# EAGLE design act-drive1 (EAGLE 9.4.2)
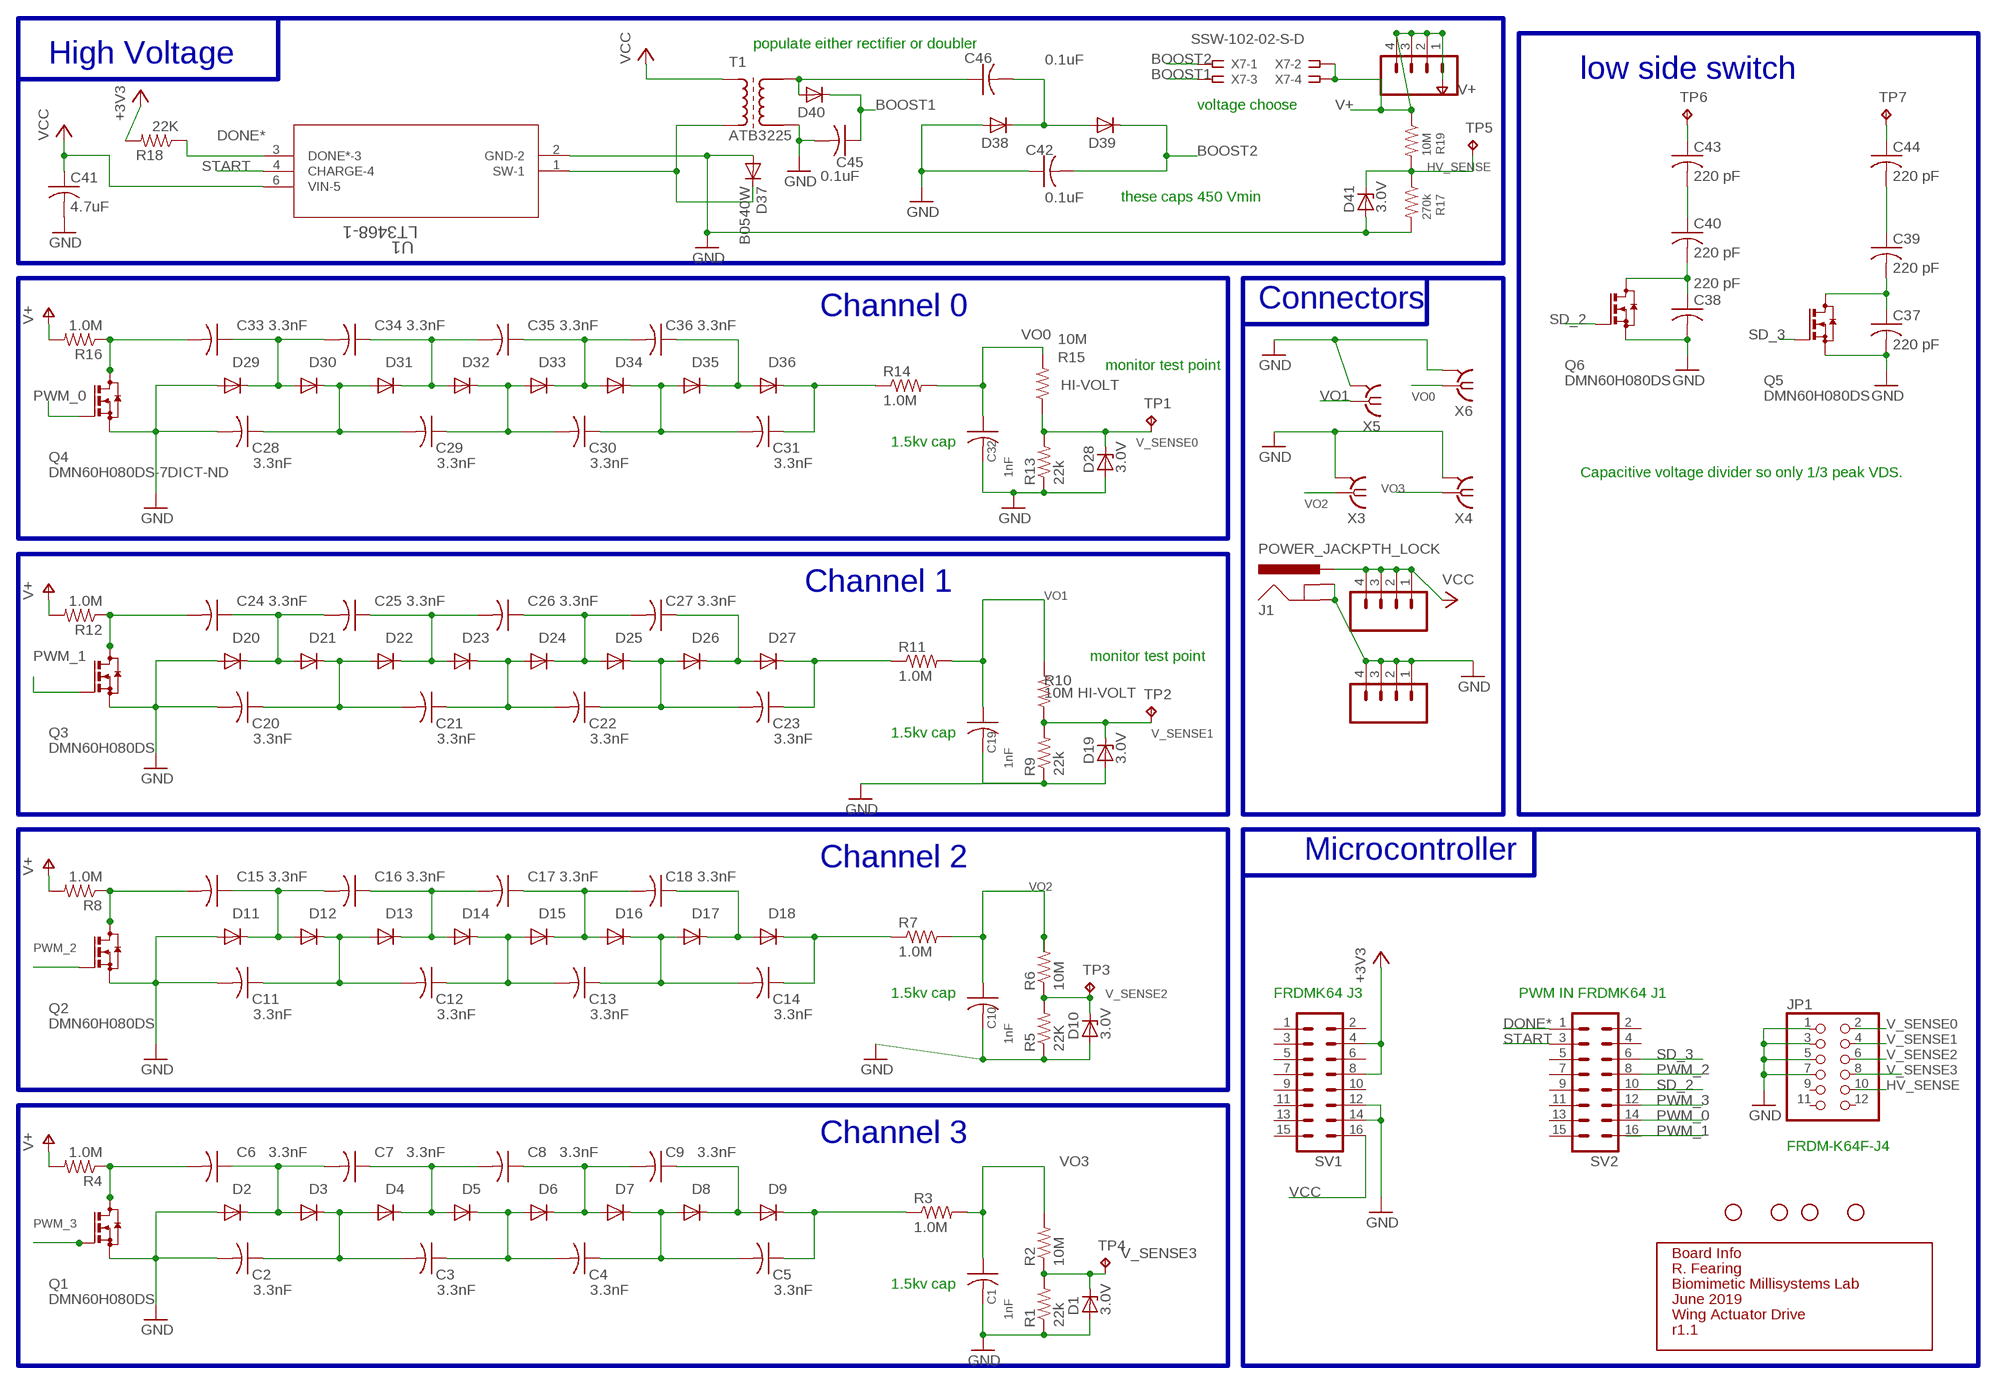
[diagram p0: schematic, sheet 1]

## Parts
C1  1nF  C-USC1206  [C1206]
C2  3.3nF  C-USC0805K  [C0805K]
C3  3.3nF  C-USC0805K  [C0805K]
C4  3.3nF  C-USC0805K  [C0805K]
C5  3.3nF  C-USC0805K  [C0805K]
C6  3.3nF  C-USC0805K  [C0805K]
C7  3.3nF  C-USC0805K  [C0805K]
C8  3.3nF  C-USC0805K  [C0805K]
C9  3.3nF  C-USC0805K  [C0805K]
C10  1nF  C-USC1206  [C1206]
C11  3.3nF  C-USC0805K  [C0805K]
C12  3.3nF  C-USC0805K  [C0805K]
C13  3.3nF  C-USC0805K  [C0805K]
C14  3.3nF  C-USC0805K  [C0805K]
C15  3.3nF  C-USC0805K  [C0805K]
C16  3.3nF  C-USC0805K  [C0805K]
C17  3.3nF  C-USC0805K  [C0805K]
C18  3.3nF  C-USC0805K  [C0805K]
C19  1nF  C-USC1206  [C1206]
C20  3.3nF  C-USC0805K  [C0805K]
C21  3.3nF  C-USC0805K  [C0805K]
C22  3.3nF  C-USC0805K  [C0805K]
C23  3.3nF  C-USC0805K  [C0805K]
C24  3.3nF  C-USC0805K  [C0805K]
C25  3.3nF  C-USC0805K  [C0805K]
C26  3.3nF  C-USC0805K  [C0805K]
C27  3.3nF  C-USC0805K  [C0805K]
C28  3.3nF  C-USC0805K  [C0805K]
C29  3.3nF  C-USC0805K  [C0805K]
C30  3.3nF  C-USC0805K  [C0805K]
C31  3.3nF  C-USC0805K  [C0805K]
C32  1nF  C-USC1206  [C1206]
C33  3.3nF  C-USC0805K  [C0805K]
C34  3.3nF  C-USC0805K  [C0805K]
C35  3.3nF  C-USC0805K  [C0805K]
C36  3.3nF  C-USC0805K  [C0805K]
C37  220 pF  C-USC1206  [C1206]
C38  220 pF  C-USC1206  [C1206]
C39  220 pF  C-USC1206  [C1206]
C40  220 pF  C-USC1206  [C1206]
C41  4.7uF  C-USC1206  [C1206]
C42  0.1uF  C-USC1206  [C1206]
C43  220 pF  C-USC1206  [C1206]
C44  220 pF  C-USC1206  [C1206]
C45  0.1uF  C-USC1206  [C1206]
C46  0.1uF  C-USC1206  [C1206]
D1  3.0V  ZENER-DIODESOD80C  [SOD80C]
D2  DIODE-SOD323-W  [SOD323-W]
D3  DIODE-SOD323-W  [SOD323-W]
D4  DIODE-SOD323-W  [SOD323-W]
D5  DIODE-SOD323-W  [SOD323-W]
D6  DIODE-SOD323-W  [SOD323-W]
D7  DIODE-SOD323-W  [SOD323-W]
D8  DIODE-SOD323-W  [SOD323-W]
D9  DIODE-SOD323-W  [SOD323-W]
D10  3.0V  ZENER-DIODESOD80C  [SOD80C]
D11  DIODE-SOD323-W  [SOD323-W]
D12  DIODE-SOD323-W  [SOD323-W]
D13  DIODE-SOD323-W  [SOD323-W]
D14  DIODE-SOD323-W  [SOD323-W]
D15  DIODE-SOD323-W  [SOD323-W]
D16  DIODE-SOD323-W  [SOD323-W]
D17  DIODE-SOD323-W  [SOD323-W]
D18  DIODE-SOD323-W  [SOD323-W]
D19  3.0V  ZENER-DIODESOD80C  [SOD80C]
D20  DIODE-SOD323-W  [SOD323-W]
D21  DIODE-SOD323-W  [SOD323-W]
D22  DIODE-SOD323-W  [SOD323-W]
D23  DIODE-SOD323-W  [SOD323-W]
D24  DIODE-SOD323-W  [SOD323-W]
D25  DIODE-SOD323-W  [SOD323-W]
D26  DIODE-SOD323-W  [SOD323-W]
D27  DIODE-SOD323-W  [SOD323-W]
D28  3.0V  ZENER-DIODESOD80C  [SOD80C]
D29  DIODE-SOD323-W  [SOD323-W]
D30  DIODE-SOD323-W  [SOD323-W]
D31  DIODE-SOD323-W  [SOD323-W]
D32  DIODE-SOD323-W  [SOD323-W]
D33  DIODE-SOD323-W  [SOD323-W]
D34  DIODE-SOD323-W  [SOD323-W]
D35  DIODE-SOD323-W  [SOD323-W]
D36  DIODE-SOD323-W  [SOD323-W]
D37  B0540W  DIODE-SOD123  [SOD123]
D38  DIODE-SOD323-W  [SOD323-W]
D39  DIODE-SOD323-W  [SOD323-W]
D40  DIODE-SOD323-W  [SOD323-W]
D41  3.0V  ZENER-DIODESOD80C  [SOD80C]
H1  STAND-OFFTIGHT  [STAND-OFF-TIGHT]
H2  STAND-OFFTIGHT  [STAND-OFF-TIGHT]
H3  STAND-OFFTIGHT  [STAND-OFF-TIGHT]
H4  STAND-OFFTIGHT  [STAND-OFF-TIGHT]
I1  INFO  [INFO]
J1  POWER_JACKPTH_LOCK  [POWER_JACK_PTH_LOCK]
JP1  PINHD-2X6  [2X06]
JP2  M04LOCK  [1X04_LOCK]
JP3  M04LOCK  [1X04_LOCK]
JP4  M04LOCK  [1X04_LOCK]
Q1  BSS123  [SOT23]
Q2  BSS123  [SOT23]
Q3  BSS123  [SOT23]
Q4  BSS123  [SOT23]
Q5  BSS123  [SOT23]
Q6  BSS123  [SOT23]
R1  22k  R-US_R1206  [R1206]
R2  10M  R-US_R2010  [R2010]
R3  1.0M  R-US_R1206  [R1206]
R4  1.0M  R-US_R1206  [R1206]
R5  22K  R-US_R1206  [R1206]
R6  10M  R-US_R2010  [R2010]
R7  1.0M  R-US_R1206  [R1206]
R8  1.0M  R-US_R1206  [R1206]
R9  22k  R-US_R1206  [R1206]
R10  10M  R-US_R2010  [R2010]
R11  1.0M  R-US_R1206  [R1206]
R12  1.0M  R-US_R1206  [R1206]
R13  22k  R-US_R1206  [R1206]
R14  1.0M  R-US_R1206  [R1206]
R15  10M  R-US_R2010  [R2010]
R16  1.0M  R-US_R1206  [R1206]
R17  270k  R-US_R1206  [R1206]
R18  22K  R-US_R1206  [R1206]
R19  10M  R-US_R1206  [R1206]
SV1  ML16  [ML16]
SV2  ML16  [ML16]
T1  ATB3225  [XFMR3225]
TP1  TPTP10SQ  [TP10SQ]
TP2  TPTP10SQ  [TP10SQ]
TP3  TPTP10SQ  [TP10SQ]
TP4  TPTP10SQ  [TP10SQ]
TP5  TPTP20SQ  [TP20SQ]
TP6  TPTP20SQ  [TP20SQ]
TP7  TPTP20SQ  [TP20SQ]
U1  LT3468-1  [TSOT-23_S5]
X3  SMA-142-0701-801/806  [J502-ND-142-0701-801/806]
X4  SMA-142-0701-801/806  [J502-ND-142-0701-801/806]
X5  SMA-142-0701-801/806  [J502-ND-142-0701-801/806]
X6  SMA-142-0701-801/806  [J502-ND-142-0701-801/806]
X7  SSW-102-02-S-D  [SSW-102-02-S-D]

## Nets
+3V3: R18.2 SV1.4 SV1.8
BOOST: C46.2 D38.C D39.A
BOOST1: C45.1 D40.C X7.3
BOOST2: C42.2 D39.C X7.1
DONE*: R18.1 SV2.1 U1.3(DONE*-3)
GND: C1.2 C2.2 C10.2 C11.2 C19.2 C20.2 C28.2 C32.2 C37.2 C38.2 C41.2 C42.1 C45.2 D1.A D2.A D10.A D11.A D19.A D20.A D28.A D29.A D37.A D38.A D41.A J1.GND J1.GNDBREAK JP1.1 JP1.3 JP1.5 JP1.7 JP2.1 JP2.2 JP2.3 JP2.4 Q1.2(S) Q2.2(S) Q3.2(S) Q4.2(S) Q5.2(S) Q6.2(S) R1.1 R5.1 R9.1 R13.1 R17.2 SV1.12 SV1.14 T1.S3 U1.2(GND-2) X3.G@1 X3.G@2 X3.G@3 X3.G@4 X4.G@1 X4.G@2 X4.G@3 X4.G@4 X5.G@1 X5.G@2 X5.G@3 X5.G@4 X6.G@1 X6.G@2 X6.G@3 X6.G@4
HV_SENSE: D41.C JP1.10 R17.1 R19.2 TP5.TP
N$1: C29.1 C30.2 D32.C D33.A
N$2: C33.1 C34.2 D29.C D30.A
N$3: C31.1 D36.C R14.1
N$4: C14.1 D18.C R7.1
N$5: C28.1 C29.2 D30.C D31.A
N$6: C46.1 D40.A T1.S2
N$7: C34.1 C35.2 D31.C D32.A
N$8: C33.2 Q4.3(D) R16.1
N$9: C23.1 D27.C R11.1
N$10: C35.1 C36.2 D33.C D34.A
N$11: C24.1 C25.2 D20.C D21.A
N$12: D37.C T1.P4 U1.1(SW-1)
N$13: C20.1 C21.2 D21.C D22.A
N$14: C27.1 D26.C D27.A
N$15: C21.1 C22.2 D23.C D24.A
N$16: C22.1 C23.2 D25.C D26.A
N$17: C15.1 C16.2 D11.C D12.A
N$18: C11.1 C12.2 D12.C D13.A
N$20: C18.1 D17.C D18.A
N$21: C25.1 C26.2 D22.C D23.A
N$22: C26.1 C27.2 D24.C D25.A
N$23: C24.2 Q3.3(D) R12.1
N$24: C12.1 C13.2 D14.C D15.A
N$25: C13.1 C14.2 D16.C D17.A
N$26: C5.1 D9.C R3.1
N$27: C16.1 C17.2 D13.C D14.A
N$29: C17.1 C18.2 D15.C D16.A
N$30: C15.2 Q2.3(D) R8.1
N$32: C6.1 C7.2 D2.C D3.A
N$33: C2.1 C3.2 D3.C D4.A
N$34: C9.1 D8.C D9.A
N$35: C3.1 C4.2 D5.C D6.A
N$36: C4.1 C5.2 D7.C D8.A
N$37: C7.1 C8.2 D4.C D5.A
N$38: C8.1 C9.2 D6.C D7.A
N$39: C6.2 Q1.3(D) R4.1
N$40: C43.1 TP6.TP
N$41: C40.1 C43.2
N$42: C38.1 C40.2 Q6.3(D)
N$43: C44.1 TP7.TP
N$44: C39.1 C44.2
N$45: C37.1 C39.2 Q5.3(D)
N$59: C36.1 D35.C D36.A
N$61: C30.1 C31.2 D34.C D35.A
PWM_0: Q4.1(G) SV2.14
PWM_1: Q3.1(G) SV2.16
PWM_2: Q2.1(G) SV2.8
PWM_3: Q1.1(G) SV2.12
SD_2: Q6.1(G) SV2.10
SD_3: Q5.1(G) SV2.6
START: SV2.3 U1.4(CHARGE-4)
V+: JP4.1 JP4.2 JP4.3 JP4.4 R4.2 R8.2 R12.2 R16.2 R19.1 X7.2 X7.4
V_SENSE0: D28.C JP1.2 R13.2 R15.1 TP1.TP
V_SENSE1: D19.C JP1.4 R9.2 R10.1 TP2.TP
V_SENSE2: D10.C JP1.6 R5.2 R6.1 TP3.TP
V_SENSE3: D1.C JP1.8 R1.2 R2.1 TP4.TP
VCC: C41.1 J1.PWR JP3.1 JP3.2 JP3.3 JP3.4 SV1.16 T1.P1 U1.6(VIN-5)
VO0: C32.1 R14.2 R15.2 X6.1
VO1: C19.1 R10.2 R11.2 X5.1
VO2: C10.1 R6.2 R7.2 X3.1
VO3: C1.1 R2.2 R3.2 X4.1
Unconnected: JP1.9 JP1.11 JP1.12 SV1.1 SV1.2 SV1.3 SV1.5 SV1.6 SV1.7 SV1.9 SV1.10 SV1.11 SV1.13 SV1.15 SV2.2 SV2.4 SV2.5 SV2.7 SV2.9 SV2.11 SV2.13 SV2.15

## Buses
B$1
B$3
B$5
B$6
B$7
B$8

## Notes on the sheet
- populate either rectifier or doubler
- High Voltage
- low side switch
- voltage choose
- these caps 450 Vmin
- Channel 0
- Connectors
- monitor test point
- 1.5kv cap
- Capacitive voltage divider so only 1/3 peak VDS.
- Channel 1
- monitor test point
- 1.5kv cap
- Channel 2
- Microcontroller
- 1.5kv cap | FRDMK64 J3 | PWM IN FRDMK64 J1
- Channel 3
- FRDM-K64F-J4
- 1.5kv cap

## Library data of the parts
C1 C10 C19 C32 = rcl:C-US: CAPACITOR, American symbol; DIGIKEY: 399-7078-1-ND
C2-C9 C11-C18 C20-C31 C34-C36 = rcl:C-US: CAPACITOR, American symbol; SPICEPREFIX: C
C33 = rcl:C-US: CAPACITOR, American symbol; DIGIKEY: 399-5576-1-ND; SPICEPREFIX: C
C37-C40 C43 C44 = rcl:C-US: CAPACITOR, American symbol; DIGIKEY: 311-4469-1-ND; SPICEPREFIX: C
C41 = rcl:C-US: CAPACITOR, American symbol; DIGIKEY: 399-1265-1-ND
C42 C45 C46 = rcl:C-US: CAPACITOR, American symbol; DIGIKEY: 445-7758-1-ND; SPICEPREFIX: C
D1 D10 D19 = diode:ZENER-DIODE: Z-Diode
D2-D9 D11-D17 D22 D23 D25-D27 D30-D36 D38-D40 = diode:DIODE-: DIODE; PANASONIC: DA2JF8100L
D18 D20 D21 D24 D29 = diode:DIODE-: DIODE; DIGIKEY: DA2JF8100LCT-ND; PANASONIC: DA2JF8100L
D28 D41 = diode:ZENER-DIODE: Z-Diode; DIGIKEY: MM3Z3V0ST1GOSCT-ND
D37 = diode:DIODE-: DIODE; DIGIKEY: B0540W-FDICT-ND
H1-H4 = SparkFun-Hardware:STAND-OFF: Stand Off Drill holes for mechanically mounting via screws, standoffs, etc. Note: Use the keepout ring to avoid running the screw head into surrounding components. Variant Overviews STAND-OFF - Mechanical footprint for a #4 phillips button head screw. STAND-OFF-TIGHT - Mechanical footprint for a #4 phillips button head screw, Example SparkFun Products Screw - Phillips Head (1/4", 4-40, 10 pack) <https://www.sparkfun.com/products/10453> (PRT-10453) Screw - Phillips Head (1/2", 4-40, 10 pack) <https://www.sparkfun.com/products/10452> (PRT-10452) Screw - Phillips Head (3/4", 4-40, 10 pack) <https://www.sparkfun.com/products/10451> (PRT-10451) Screw - Phillips Head (1", 4-40, 10 pack) <https://www.sparkfun.com/products/10450> (PRT-10450)
I1 = modular_robotics:INFO; AUTHOR: R. Fearing; DATE: June 2019; DESIGN: Wing Actuator Drive; ORGANIZATION: Biomimetic Millisystems Lab; REVISION: r1.1
J1 = SparkFun-Connectors:POWER_JACK: Power Jack This is the standard 5.5mm barrel jack for power. The PTH is the most common, proven, reliable, footprint. The Slot footprint only works if the mill layer is transmitted to the PCB fab house so be warned. Mating wall wart : TOL-00298 (and others); DIGIKEY: CP-202A-ND; DIMENSIONS: 5.5mm-diam; PROD_ID: PRT-00119
JP1 = pinhead:PINHD-2X6: PIN HEADER
JP2-JP4 = modular_robotics:M04: Header 4 Standard 4-pin 0.1" header. Use with straight break away headers (SKU : PRT-00116), right angle break away headers (PRT-00553), swiss pins (PRT-00743), machine pins (PRT-00117), and female headers (PRT-00115). Molex polarized connector foot print use with SKU : PRT-08231 with associated crimp pins and housings. 1MM SMD Version SKU: PRT-10208
Q1-Q3 = transistor-small-signal:BSS123: N-CHANNEL MOS FET; PART#: DMN60H080DS
Q4 = transistor-small-signal:BSS123: N-CHANNEL MOS FET; DIGIKEY: DMN60H080DS-7DICT-ND; MOUSER: 621-DMN60H080DS-7
Q5 Q6 = transistor-small-signal:BSS123: N-CHANNEL MOS FET; DIGIKEY: DMN60H080DS-7DICT-ND; PART#: DMN60H080DS
R1 R5 R9 = rcl:R-US_: RESISTOR, American symbol
R2 R6 R10 R15 = rcl:R-US_: RESISTOR, American symbol; DIGIKEY: CHV2010-FX-1005ELFCT-ND; HI-VOLT: 2000
R3 R4 R7 R8 R11 R12 R14 R16 = rcl:R-US_: RESISTOR, American symbol; DIGIKEY: P1.0MECT-ND
R13 = rcl:R-US_: RESISTOR, American symbol; DIGIKEY: P22KECT-ND
R17 = rcl:R-US_: RESISTOR, American symbol; DIGIKEY: P270KECT-ND
R18 = resistor:R-US_: RESISTOR, American symbol
R19 = rcl:R-US_: RESISTOR, American symbol; DIGIKEY: P10MECT-ND
SV1 SV2 = con-harting-ml:ML16: HARTING; DIGIKEY: ED10523-ND; OC_FARNELL: unknown; OC_NEWARK: unknown
T1 = ActuatorDrive:ATB3225: TDK ATB3225 xfmr 10:1; DIGIKEY: 445-8636-1-ND
TP1-TP7 = testpad:TP: Test pad
U1 = ActuatorDrive:LT3468-1: Boost Converter; DIGIKEY: LT3468ES5#TRMPBFCT-ND
X3 X4 X6 = con-coax:SMA-: SMA 50 Ohm End Launch Jack Receptacle - Round Contact Johnson Components Source: www.johnsoncomponents.com .. J502-ND.pdf; MF: JOHNSON COMPONENTS; MPN: 142-0701-801; OC_FARNELL: 1608592; OC_NEWARK: 90F2624
X5 = con-coax:SMA-: SMA 50 Ohm End Launch Jack Receptacle - Round Contact Johnson Components Source: www.johnsoncomponents.com .. J502-ND.pdf; DIGIKEY: J502-ND; MF: JOHNSON COMPONENTS; MPN: 142-0701-801; OC_FARNELL: 1608592; OC_NEWARK: 90F2624
X7 = con-samtec:SSW-102-02-S-D: THROUGH-HOLE .025" SQ POST SOCKET Source: Samtec SSW.pdf; MPN: SSW-102-02-S-D; OC_FARNELL: unknown; OC_NEWARK: 11P9349

## Net classes
0 default: clearance 0.205 mm

## Board
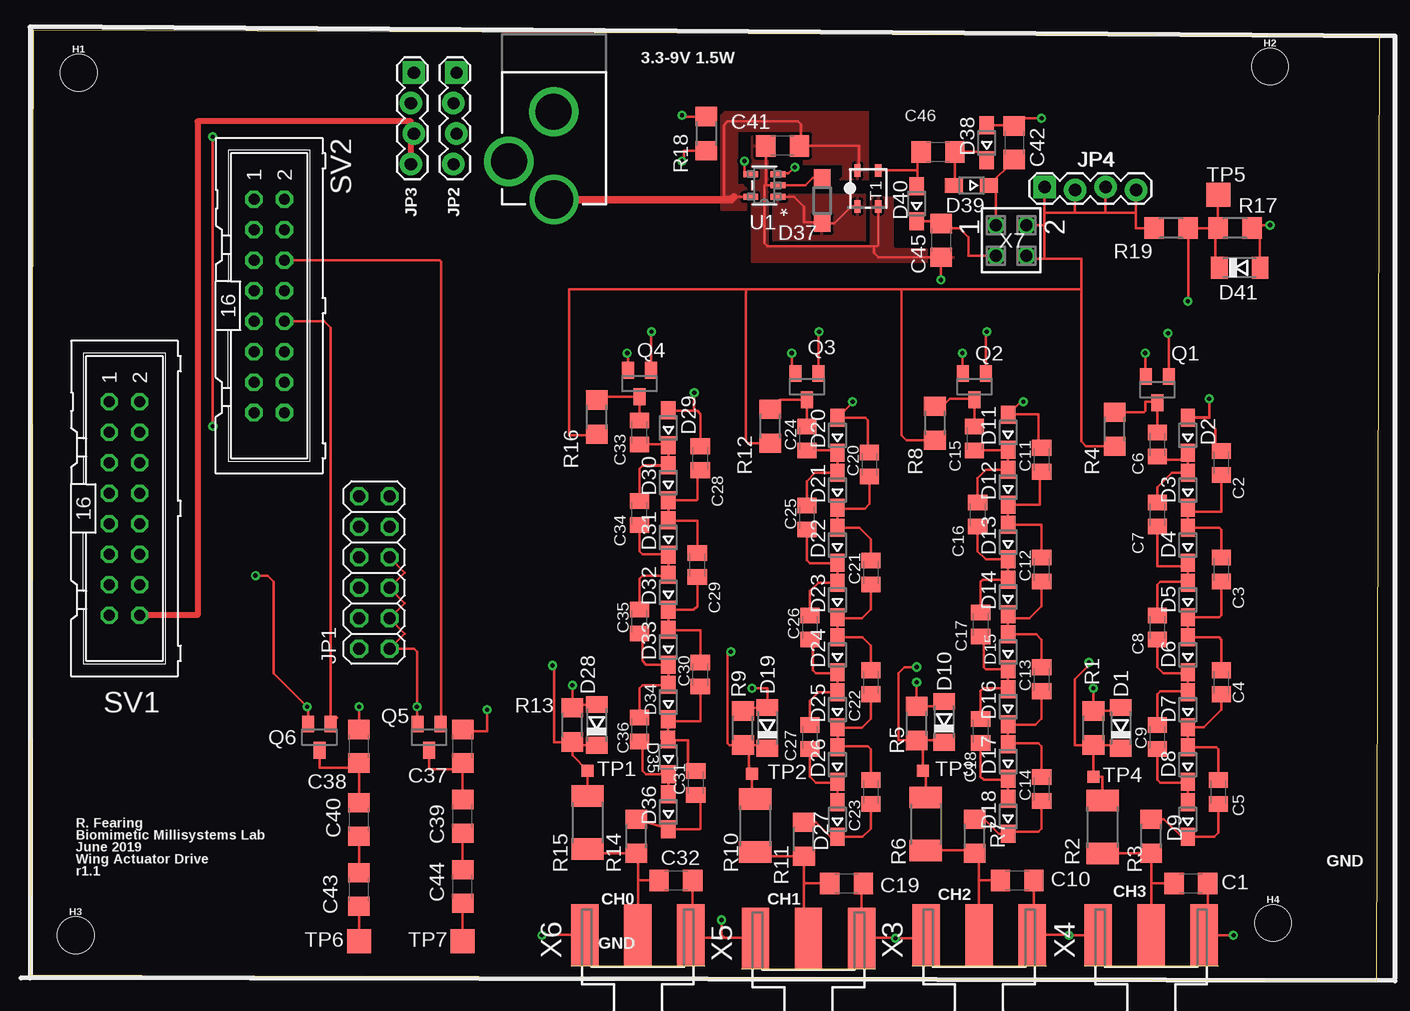
[diagram p1: board, top side]
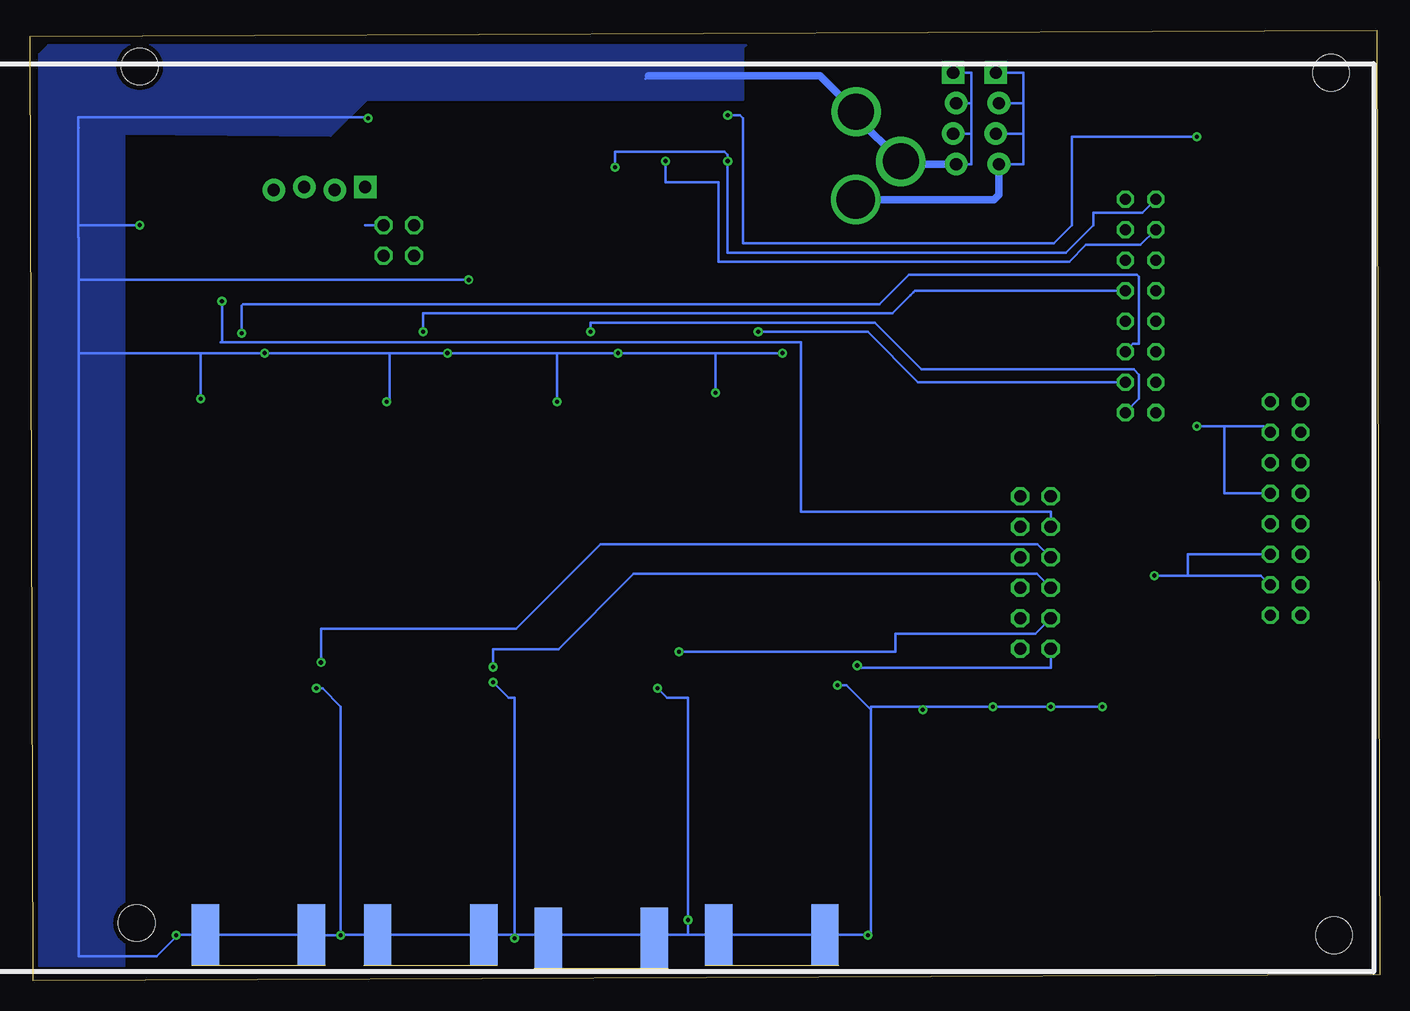
[diagram p2: board, bottom side, seen from below]

Size 112.52 x 79.25 mm. Coordinates in mm from the lower left corner, seen from the top.
Outline: 0,0.51 112.27,0 112.52,78.74 0.25,79.25 0,0.51
Copper layers (1*16): Top 0.035mm / dielectric 1.5mm / Bottom 0.035mm
Design rules "default *": minimum track width 6mil, minimum drill 10mil, track to track 6mil, track to pad 6mil, pad to pad 6mil, via to via 6mil, smd to smd 6mil, copper to edge 10mil, drill to drill 8mil, minimum pad ring 10mil, minimum via ring 8mil, stop-mask expansion 4mil, vias tented up to drill 0mil, thermal gap 10mil

### Footprints (pad centres in the part's own frame; a part is rotated, then mirrored left to right if it is on the bottom)
C1206 = smd 1.6 x 1.8: 1 -1.4,0; 2 1.4,0
C0805K = smd 1.3 x 1.6: 1 -1,0; 2 1,0
SOD80C = smd 1.4 x 1.8: A 1.7,0; C -1.7,0
SOD323-W = smd 1.5 x 1.2: A 1.45,0; C -1.45,0
SOD123 = smd 1.4 x 1.4: A 1.9,0; C -1.9,0
STAND-OFF-TIGHT = hole 3.048: 0,0
POWER_JACK_PTH_LOCK = drill 2.997 pad 4.115: GND 0.025,6.557; GNDBREAK 3.762,10.7 | drill 3.2 pad 4.115: PWR 0,13.878
2X06 = drill 1.016 octagon: 1 -6.35,-1.27; 2 -6.35,1.27; 3 -3.81,-1.27; 4 -3.81,1.27; 5 -1.27,-1.27; 6 -1.27,1.27; 7 1.27,-1.27; 8 1.27,1.27; 9 3.81,-1.27; 10 3.81,1.27; 11 6.35,-1.27; 12 6.35,1.27
1X04_LOCK = drill 1.016 pad 1.88 square: 1 0,0.127 | drill 1.016 pad 1.88: 2 2.54,-0.127; 3 5.08,0.127; 4 7.62,-0.127
SOT23 = smd 1 x 1.4: 1 -0.95,-1.1; 2 0.95,-1.1; 3 0,1.1
R1206 = smd 1.6 x 1.803: 1 -1.422,0; 2 1.422,0
R2010 = smd 1.8 x 2.7: 1 -2.2,0; 2 2.2,0
ML16 = drill 0.914 octagon: 1 -8.89,-1.27; 2 -8.89,1.27; 3 -6.35,-1.27; 4 -6.35,1.27; 5 -3.81,-1.27; 6 -3.81,1.27; 7 -1.27,-1.27; 8 -1.27,1.27; 9 1.27,-1.27; 10 1.27,1.27; 11 3.81,-1.27; 12 3.81,1.27; 13 6.35,-1.27; 14 6.35,1.27; 15 8.89,-1.27; 16 8.89,1.27
XFMR3225 = smd 1.016 x 0.508: P1 -1.5,-0.86; P4 1.5,-0.86; S2 -1.5,0.86; S3 1.5,0.86
TP10SQ = smd 1 x 1: TP 0,0
TP20SQ = smd 2 x 2: TP 0,0
TSOT-23_S5 = smd 1.219 x 0.508: 1 -1.143,0.95; 2 -1.143,0; 3 -1.143,-0.95; 4 1.143,-0.95; 6 1.143,0.95
J502-ND-142-0701-801/806 = smd 5.08 x 2.286: 1 2.565,0; G@1 2.565,4.42; G@2 2.565,-4.42 | smd 5.08 x 2.286 bottom: G@3 2.565,4.42; G@4 2.565,-4.42
SSW-102-02-S-D = drill 1 pad 1.5 octagon: 1 -1.27,-1.27; 2 -1.27,1.27; 3 1.27,-1.27; 4 1.27,1.27

### Placement (x,y rotation side)
C1  96.77,8.13 0 top
C2  99.31,43.18 90 top
C3  99.31,34.29 90 top
C4  99.31,24.89 90 top
C5  99.06,15.75 90 top
C6  93.98,44.7 90 top
C7  93.98,38.86 90 top
C8  93.98,29.46 90 top
C9  93.98,20.32 90 top
C10  82.3,8.38 0 top
C11  84.33,43.43 90 top
C12  84.33,34.29 90 top
C13  84.33,25.15 90 top
C14  84.33,16 90 top
C15  78.74,45.21 90 top
C16  78.99,38.86 90 top
C17  79.25,29.72 90 top
C18  79.25,20.83 90 top
C19  68.07,8.13 0 top
C20  69.98,43.05 90 top
C21  70.1,34.04 90 top
C22  70.1,24.89 90 top
C23  70.1,15.75 90 top
C24  64.77,45.21 90 top
C25  64.77,38.61 90 top
C26  65.02,29.46 90 top
C27  65.02,20.32 90 top
C28  55.88,43.56 90 top
C29  55.63,34.67 90 top
C30  55.88,25.53 90 top
C31  55.5,16.51 90 top
C32  53.85,8.38 0 top
C33  50.8,45.72 90 top
C34  50.8,38.99 90 top
C35  50.8,29.97 90 top
C36  50.8,20.95 90 top
C37  36.07,19.56 90 top
C38  27.43,19.56 90 top
C39  36.07,13.72 90 top
C40  27.43,13.46 90 top
C41  62.74,69.6 180 top
C42  82.04,69.85 270 top
C43  27.43,7.62 90 top
C44  36.07,7.87 90 top
C45  75.95,61.72 270 top
C46  75.69,69.09 0 top
D1  90.93,21.08 90 top
D2  96.52,45.47 90 top
D3  96.52,40.89 90 top
D4  96.52,36.32 90 top
D5  96.52,31.75 90 top
D6  96.52,27.18 90 top
D7  96.52,22.61 90 top
D8  96.52,18.03 90 top
D9  96.52,13.46 90 top
D10  76.2,21.59 90 top
D11  81.53,45.72 90 top
D12  81.53,41.15 90 top
D13  81.53,36.58 90 top
D14  81.53,32 90 top
D15  81.53,27.43 90 top
D16  81.53,22.86 90 top
D17  81.53,18.29 90 top
D18  81.53,13.72 90 top
D19  61.47,21.08 90 top
D20  67.31,45.47 90 top
D21  67.31,40.89 90 top
D22  67.31,36.32 90 top
D23  67.31,31.75 90 top
D24  67.31,27.18 90 top
D25  67.31,22.61 90 top
D26  67.31,18.03 90 top
D27  67.31,13.46 90 top
D28  47.24,21.34 90 top
D29  53.21,46.1 90 top
D30  53.21,41.53 90 top
D31  53.21,36.96 90 top
D32  53.21,32.38 90 top
D33  53.21,27.81 90 top
D34  53.21,23.24 90 top
D35  53.21,18.67 90.8 top
D36  53.21,14.1 90 top
D37  66.04,65.02 90 top
D38  79.76,69.85 90 top
D39  78.49,66.29 180 top
D40  73.91,64.77 90 top
D41  100.84,59.44 0 top
H1  4.06,75.69 0 top
H2  103.38,76.2 0 top
H3  3.81,3.81 0 top
H4  103.63,4.83 0 top
I1  3.81,8.76 0 top
J1  43.69,78.99 180 top
JP1  28.7,34.04 90 top
JP2  35.43,75.69 270 top
JP3  31.88,75.69 270 top
JP4  84.58,66.04 0 top
Q1  93.98,49.28 180 top
Q2  78.74,49.53 180 top
Q3  64.77,49.53 180 top
Q4  50.8,49.78 180 top
Q5  33.27,20.32 180 top
Q6  24.13,20.32 180 top
R1  88.65,21.08 270 top
R2  89.41,12.83 270 top
R3  93.47,12.07 270 top
R4  90.42,45.97 270 top
R5  73.91,21.46 270 top
R6  74.68,13.08 270 top
R7  78.74,12.07 270 top
R8  75.44,46.48 270 top
R9  59.44,21.08 270 top
R10  60.45,12.95 270 top
R11  64.52,11.81 270 top
R12  61.72,46.23 270 top
R13  45.21,21.34 270 top
R14  50.55,12.07 270 top
R15  46.48,13.21 270 top
R16  47.24,46.99 270 top
R17  100.46,62.74 0 top
R18  56.39,70.61 90 top
R19  95.12,62.74 0 top
SV1  7.87,39.37 270 top
SV2  19.94,56.26 270 top
T1  69.85,66.04 270 top
TP1  46.48,17.53 0 top
TP2  60.2,17.27 0 top
TP3  74.42,17.53 0 top
TP4  88.65,17.02 0 top
TP5  99.06,65.53 0 top
TP6  27.43,3.3 0 top
TP7  36.07,3.3 0 top
U1  61.21,66.29 180 top
X3  79.12,1.27 90 top
X4  93.47,1.27 90 top
X5  64.9,1.02 90 top
X6  50.67,1.27 90 top
X7  81.79,61.72 270 top

### Tracks (layer width: path | path; a pad name or v marks a point on that pad's centre or on a via)
+3V3  (via drill 0.35)
  Top 0.203: R18.2 54.46,72.03 v54.36,72.14 | v15.24,70.36 15.24,46.24 v15.25,46.23
  Bottom 0.203: v54.36,72.14 53.34,72.14 53.09,71.88 53.09,61.47 27.18,61.47 25.65,62.99 25.65,70.36 v15.24,70.36 | SV1.4 9.65,46.23 12.95,46.23 | 12.95,46.23 v15.25,46.23 | SV1.8 12.95,40.64 12.95,46.23
BOOST
  Top 0.203: D39.A 77.09,66.35 C46.2 79.07,69.09 D38.C
BOOST1
  Top 0.203: D40.C 75.75,63.32 C45.1 76.33,62.74 77.47,62.74 78.23,61.98 78.23,60.45 X7.3
BOOST2
  Top 0.203: C42.2 82.04,68.4 D39.C 80.52,65.71 X7.1
DONE*  (via drill 0.35)
  Top 0.203: U1.3 62.42,67.31 63.25,67.31 v63.75,67.82 | v54.36,68.33 54.51,68.48 54.51,69.19 R18.1
  Bottom 0.203: v63.75,67.82 63.75,69.09 54.61,69.09 54.36,68.83 v54.36,68.33 54.36,60.71 26.16,60.71 23.88,62.99 23.88,64.01 19.81,64.01 SV2.1
GND  (via drill 0.35)
  Top 0.152: 53.27,47.5 D29.A | 36.2,20.83 C37.2 | 69.32,7.97 C19.2
  Top 0.203: C28.2 55.88,47.24 55.63,47.5 55.37,47.5 | 55.37,47.5 53.27,47.5 | C2.2 98.81,44.69 98.81,45.97 97.79,46.99 | 98.04,46.99 98.3,46.99 98.22,46.92 D2.A | 98.04,46.99 97.79,46.99 | 97.79,46.99 96.59,46.99 D2.A | D1.A 90.65,22.5 R1.1 v88.65,24.38 | D10.A 75.8,22.88 R5.1 v73.91,24.89 | C11.2 84.07,44.69 84.07,47.24 81.61,47.24 D11.A | R9.1 59.71,22.78 D19.A 61.47,24.38 v60.2,24.38 | C32.2 55.25,4.83 55.09,4.67 X6.G@2 55.35,3.58 57.89,3.58 | D28.A 45.21,23.04 R13.1 v45.21,24.64 | 57.66,4.83 v57.66,5.08 57.66,3.81 57.89,3.58 | v55.37,49.02 55.37,47.5 | Q3.2 63.5,50.95 v63.5,52.32 | Q4.2 49.85,52.26 v49.78,52.32 | v77.72,52.32 77.72,50.7 Q2.2 78.06,50.63 | Q1.2 92.96,50.44 v92.96,52.32 | D2.A 97.97,46.92 98.04,46.99 | D2.A 97.72,46.92 97.79,46.99 | D2.A 96.7,46.92 | v98.3,48.51 98.3,46.92 D2.A | D11.A 81.71,47.17 | v82.8,48.26 82.62,48.26 D11.A | v68.58,48.26 68.58,48.19 67.35,46.95 | D20.A 67.35,46.95 | C20.2 69.85,44.18 69.85,46.74 69.63,46.95 67.35,46.95 | v38.1,22.61 38.1,20.83 36.2,20.83 | Q5.2 32.26,21.49 v32.26,22.86 32.26,27.43 32,27.69 JP1.1 31.24,28.96 JP1.3 31.24,31.5 JP1.5 31.24,34.04 JP1.7 | Q6.2 23.18,22.79 v23.11,22.86 20.32,25.65 20.32,33.27 19.81,33.78 v18.8,33.78 | v27.43,22.86 C38.2 | D37.A 65.28,66.92 64.65,66.29 U1.2 61.21,66.29 | T1.S3 70.71,61.31 70.61,61.21 70.36,61.21 | 70.36,61.21 61.47,61.21 61.21,61.47 61.21,66.29 | 70.36,61.21 70.36,60.71 70.74,60.32 C45.2 v75.95,58.42 | v84.33,71.88 82.04,71.88 C42.1 81.99,71.3 D38.A | C41.2 61.34,66.42 61.21,66.29 | C1.2 98.17,4.12 97.95,3.9 | 97.95,3.9 X4.G@2 | R17.2 102.12,62.98 | 102.12,62.98 102.13,62.99 v103.38,62.99 | 69.47,4.12 69.22,3.9 69.22,3.68 X5.G@2
  Top 0.203: X5.G@2 69.32,7.97 | X6.G@1 42.7,3.83 v42.67,3.81 | X5.G@1 57.89,3.58 | X5.G@2 72.11,3.58 v72.14,3.56 74.42,3.56 X3.G@3 | v100.33,3.81 98.04,3.81 97.95,3.9 | C10.2 83.7,3.99 X3.G@2 86.59,3.83 v86.61,3.81 89.03,3.81 X4.G@1 | D41.A 102.54,62.56 102.12,62.98
  Top 0.254: 55.12,3.86 X6.G@2 | X5.G@1 60.25,3.81
  Bottom 0.203: v60.2,24.38 59.44,23.62 57.66,23.62 v57.66,5.08 57.66,3.83 | 55.37,52.32 v63.5,52.32 68.58,52.32 | 55.37,52.32 v55.37,49.02 | v49.78,52.32 55.37,52.32 | 68.58,52.32 v77.72,52.32 82.55,52.32 | 82.55,52.32 v92.96,52.32 98.3,52.32 | v98.3,48.51 98.3,52.32 | 98.3,52.32 108.46,52.32 | 108.46,52.32 108.46,58.42 | 108.46,58.42 108.46,61.95 108.48,61.98 108.48,62.99 | 82.55,52.32 82.55,48.51 v82.8,48.26 | v68.58,48.26 68.58,52.32 | X3.G@3 X3.G@2 86.59,3.83 v86.61,3.81 | X4.G@2 97.64,4.09 | 89.31,4.09 X4.G@1 | X3.G@3 69.57,3.83 X5.G@2 69.1,3.58 69.34,3.83 60.22,3.83 | 108.46,52.32 108.46,2.06 101.96,2.06 100.33,3.68 v100.33,3.81 100.41,3.81 100.43,3.83 X4.G@2 | 88.39,24.38 v88.65,24.38 88.14,24.38 86.61,22.86 86.61,3.83 86.6,3.82 v86.61,3.81 | v73.91,24.89 72.64,23.62 72.14,23.62 72.14,3.86 | X3.G@3 72.16,3.83 72.14,3.86 | v45.21,24.64 44.45,24.64 42.42,22.61 | 42.42,22.61 42.42,22.86 38.35,22.86 v38.1,22.61 37.85,22.86 v32.26,22.86 v27.43,22.86 v23.11,22.86 | 42.42,22.61 42.42,3.83 42.67,3.83 | 18.78,33.53 v18.8,33.78 16,33.78 | 108.48,62.99 108.48,71.09 | 108.48,71.09 108.48,71.98 84.43,71.98 v84.33,71.88 | 108.48,71.09 108.46,71.12 | v75.95,58.42 108.46,58.42 | v103.38,62.99 108.48,62.99 | 34.04,73.15 34.04,70.61 | 34.04,70.61 34.04,68.07 JP2.4 | JP2.1 34.04,75.69 34.04,73.15 | X5.G@1 60.22,3.83 | 42.67,3.83 X6.G@1 X6.G@2 57.66,3.83 | v42.67,3.81 42.67,3.83 | 57.66,3.83 60.22,3.83 | v72.14,3.56 72.14,3.86 | X4.G@2 X4.G@1 | X4.G@1 89.03,3.81 v86.61,3.81 | J1.GND 43.63,72.44 | 60.96,75.44 61.21,75.18 | JP2.2 34.04,73.15 | JP2.3 34.04,70.61 | 16,33.78 9.91,33.78 SV1.14 | SV1.12 16,35.56 16,33.78
  Bottom 0.254: X6.G@2 55.12,3.83
  Bottom 0.61: 60.96,75.44 46.66,75.44 J1.GND 43.66,72.03 J1.GNDBREAK 39.7,68.07 JP2.4
  pour Top: 60.2,70.36 61.47,70.36 61.47,61.21 70.1,61.21 70.1,65.28 71.88,65.28 71.88,61.21 72.14,60.96 76.71,60.96 76.96,60.71 76.96,58.93 75.95,59.94 60.2,59.94
  pour Bottom: 53.09,77.72 53.09,73.45 84.43,73.45 87.45,70.43 104.65,70.61 104.65,1.27 111.76,1.27 111.76,77.22 111,77.98 52.83,77.98
HV_SENSE  (via drill 0.35)
  Top 0.203: 98.81,62.74 R19.2 96.55,56.67 v96.52,56.64 | 98.81,62.74 R17.1 99.04,65.51 TP5.TP | D41.C 98.81,59.77 98.81,62.74
  Bottom 0.203: v96.52,56.64 96.52,53.34 96.63,53.23 48.26,53.23 48.26,39.12 27.43,39.12 JP1.10
N$1
  Top 0.152: D33.A 53.27,29.21 53.29,29.21 53.21,29.29
  Top 0.203: C30.2 55.88,29.21 53.29,29.21 | C29.1 55.63,31.24 55.32,30.93 D32.C 53.21,29.29
N$2
  Top 0.152: D30.A 53.21,43.14 53,42.93 51.05,42.93 51.11,42.98
  Top 0.203: 53.21,43.14 D29.C 53.14,44.72 C33.1 | C34.2 50.8,42.67 51.05,42.93 | D30.A 51.11,42.98
N$3
  Top 0.152: 55.83,12.65 55.88,12.7 | 55.88,15.38 C31.1
  Top 0.203: R14.1 52.5,12.9 D36.C 55.83,12.65 | 55.88,12.7 55.88,15.38
N$4
  Top 0.203: C14.1 84.33,12.7 84.07,12.45 81.71,12.45 D18.C 80.77,12.27 79.55,13.49 R7.1
N$5
  Top 0.152: D31.A 53.27,38.35 | 55.57,40.08 55.63,40.13 | 55.63,42.31 C28.1
  Top 0.203: C29.2 55.63,38.35 53.27,38.35 | D31.A D30.C 55.57,40.08 | 55.63,40.13 55.63,42.31
N$6
  Top 0.203: T1.S2 73.99,67.54 | 73.99,67.54 73.99,66.29 D40.A | C46.1 73.99,68.78 73.99,67.54
N$7
  Top 0.152: D32.A 53.16,33.78 | 53.16,35.56 D31.C
  Top 0.203: C35.2 50.8,33.53 51.05,33.78 53.16,33.78 | C34.1 50.8,35.81 51.05,35.56 53.16,35.56 | D31.C D32.A
N$8
  Top 0.152: 47.52,48.68 R16.1
  Top 0.203: 47.52,48.68 Q4.3 C33.2
N$9
  Top 0.203: C23.1 70.1,12.7 69.42,12.01 D27.C 66.73,12.01 65.51,13.23 R11.1
N$10
  Top 0.152: D34.A 53.16,24.64 | 51.05,28.72 C35.1
  Top 0.203: C36.2 50.8,24.38 51.05,24.64 53.16,24.64 | 51.05,28.72 51.05,26.67 51.36,26.36 D33.C D34.A
N$11
  Top 0.203: C25.2 64.77,41.66 65.46,42.34 D21.A D20.C 67.11,44.21 C24.1
N$12
  Top 0.203: U1.1 63.69,65.34 64.52,64.52 64.52,63.25 65.92,63.25 D37.C 67.06,63.12 68.47,64.54 T1.P4
  pour Top: 61.98,65.53 69.6,65.53 69.6,61.72 61.98,61.72
N$13
  Top 0.203: C20.1 69.98,39.75 69.6,39.37 67.38,39.37 D21.C D22.A 69.16,37.77 70.1,36.83 C21.2
N$14
  Top 0.203: D27.A D26.C 67.24,16.51 65.53,16.51 65.02,17.02 C27.1
N$15
  Top 0.203: D23.C 67.31,30.23 | 67.31,30.23 D24.A 69.42,28.63 70.1,27.94 C22.2 | C21.1 70.1,30.99 69.34,30.23 67.31,30.23
N$16
  Top 0.203: C22.1 70.1,21.84 69.34,21.08 67.38,21.08 D25.C 67.35,21.12 67.35,19.52 | D26.A 67.35,19.52 | 67.35,19.52 67.38,19.56 69.85,19.56 70.1,19.3 C23.2
N$17
  Top 0.203: C16.2 78.99,41.91 79.68,42.6 D12.A D11.C 81.48,44.21 C15.1
N$18
  Top 0.203: C11.1 84.2,42.31 84.2,39.7 D12.C D13.A 84.33,38.03 C12.2
N$20
  Top 0.203: D17.C 81.53,16.76 | 81.53,16.76 D18.A | C18.1 79.25,17.02 79.5,16.76 81.53,16.76
N$21
  Top 0.203: D22.C 67.31,34.8 | 67.31,34.8 D23.A 65.71,33.2 65.02,32.51 C26.2 | C25.1 64.77,35.05 65.02,34.8 67.31,34.8
N$22
  Top 0.203: C26.1 65.28,28.21 65.28,25.91 65.53,25.65 67.24,25.65 D24.C D25.A 65.71,24.06 65.02,23.37 C27.2
N$23
  Top 0.203: R12.1 62.5,48.43 Q3.3 C24.2
N$24
  Top 0.203: D14.C 81.53,30.23 | 81.53,30.23 D15.A | D15.A 81.53,28.7 81.79,28.45 81.79,28.63 D15.A | C12.1 84.33,31.24 83.31,30.23 81.53,30.23 | D15.A 83.89,28.88 84.33,28.45 C13.2
N$25
  Top 0.203: D16.C 81.53,21.34 | 81.53,21.34 D17.A 81.61,19.81 84.07,19.81 84.33,19.56 C14.2 | C13.1 84.33,21.84 83.82,21.34 81.53,21.34
N$26
  Top 0.203: C5.1 99.06,12.34 98.73,12.01 D9.C 96.01,12.01 94.54,13.49 R3.1
N$27
  Top 0.203: C17.2 79.25,33.27 79.43,33.45 D14.A D13.C 79.68,35.13 78.99,35.81 C16.1
N$29
  Top 0.203: C17.1 79.5,28.46 79.5,26.16 79.68,25.98 D15.C 81.53,24.38 | 81.53,24.38 D16.A | C18.2 79.25,24.13 79.5,24.38 81.53,24.38
N$30
  Top 0.203: R8.1 76.1,47.9 76.71,48.51 78.66,48.51 Q2.3 C15.2
N$32
  Top 0.203: D2.C 96.52,43.43 | 96.52,43.43 D3.A 95.18,42.34 93.98,41.15 C7.2 | C6.1 94.25,43.43 96.52,43.43
N$33
  Top 0.203: C3.2 99.31,37.59 99.13,37.77 D4.A D3.C 96.85,39.12 99.31,39.12 C2.1
N$34
  Top 0.203: C9.1 93.98,16.76 94.23,16.51 96.45,16.51 D8.C D9.A
N$35
  Top 0.203: C4.2 99.31,28.45 99.13,28.63 D6.A D5.C 99.13,30.3 99.31,30.48 C3.1
N$36
  Top 0.203: C5.2 99.06,19.3 98.88,19.48 D8.A D7.C 97.86,21.16 99.31,22.61 C4.1
N$37
  Top 0.203: C8.2 93.98,33.02 94.23,33.27 96.45,33.27 | 96.45,33.27 D5.A | D4.C 96.52,34.54 | 96.52,34.54 96.52,33.35 96.45,33.27 | C7.1 93.98,34.54 96.52,34.54
N$38
  Top 0.203: D7.A 96.52,24.13 | 96.52,24.13 96.52,25.65 | 96.52,25.65 D6.C | C9.2 93.98,23.88 94.23,24.13 96.52,24.13 | C8.1 93.98,26.16 94.49,25.65 96.52,25.65
N$39
  Top 0.203: C6.2 93.73,45.96 93.73,46.14 93.98,46.4 Q1.3 93.9,48.26 92.96,48.26 92.96,47.5 92.86,47.4 R4.1 | C6.2 93.98,45.47 | 93.96,45.72 C6.2
N$40
  Top 0.203: TP6.TP C43.1
N$41
  Top 0.203: C43.2 C40.1
N$42
  Top 0.203: C40.2 C38.1 27.05,17.78 24.13,17.78 Q6.3
N$43
  Top 0.203: TP7.TP C44.1
N$44
  Top 0.203: C44.2 C39.1
N$45
  Top 0.203: 33.36,19.22 Q5.3 33.27,17.7 33.32,17.65 35.56,17.65 C37.1 C39.2
N$59
  Top 0.152: 51.05,19.7 C36.1 | 53.23,15.57 D36.A
  Top 0.203: 51.05,19.7 51.05,17.53 51.36,17.22 D35.C 53.23,15.57
N$61
  Top 0.152: C31.2 54.86,17.91 | 53.25,20.07 D35.A | 53.19,21.77 D34.C 53.34,21.66
  Top 0.203: 54.86,17.91 54.86,20.07 53.25,20.07 | D35.A 53.19,21.77 | 53.34,21.66 55.88,21.66 C30.1
PWM_0  (via drill 0.35)
  Top 0.203: Q4.1 51.75,54.1 v51.82,54.1
  Bottom 0.203: v51.82,54.1 42.67,54.1 38.48,49.91 SV2.14
PWM_1  (via drill 0.35)
  Top 0.203: Q3.1 65.72,54.1 v65.79,54.1
  Bottom 0.203: v65.79,54.1 65.79,54.86 42.09,54.86 38.2,50.97 20.52,50.97 20.07,50.52 20.07,48.51 SV2.16
PWM_2  (via drill 0.35)
  Top 0.203: Q2.1 79.69,54.1 v79.76,54.1
  Bottom 0.203: v79.76,54.1 79.76,55.63 40.64,55.63 39.12,57.15 38.86,57.4 38.73,57.53 SV2.8
PWM_3  (via drill 0.35)
  Top 0.203: Q1.1 94.93,53.98 v94.87,53.98
  Bottom 0.203: 94.87,54.23 v94.87,53.98 94.87,56.26 94.74,56.39 41.72,56.39 39.27,58.85 20.24,58.85 20.07,58.67 20.07,53.09 20.57,53.09 SV2.12
SD_2
  Top 0.203: 25.59,21.93 Q6.1 25.08,54.42 24.51,54.99 SV2.10
SD_3
  Top 0.203: Q5.1 34.29,21.49 34.29,59.94 34.16,60.07 SV2.6
START  (via drill 0.35)
  Top 0.203: U1.4 59.55,67.24 v59.55,68.33
  Bottom 0.203: v59.55,68.33 59.55,66.55 55.12,66.55 55.12,59.94 25.9,59.96 24.51,61.34 20.83,61.34 20.7,61.34 19.94,61.34 SV2.3
V+
  Top 0.203: X7.4 83.31,60.2 84.58,60.2 | 84.58,60.2 87.63,60.2 87.63,57.66 | 87.63,57.66 87.63,44.96 88.04,44.55 R4.2 | R8.2 73.05,45.06 72.64,45.47 72.64,57.66 | 72.64,57.66 87.63,57.66 | R12.2 59.84,44.81 59.69,44.96 59.69,57.66 | 59.69,57.66 72.64,57.66 | R16.2 47.14,45.47 44.96,45.47 44.96,57.66 59.69,57.66 | X7.2 84.58,62.99 | 84.58,62.99 JP4.1 84.58,64.01 87.12,64.01 | 89.66,64.01 92.2,64.01 JP4.4 92.2,62.74 R19.1 | JP4.2 87.12,64.01 | JP4.3 89.66,64.01 | 89.66,64.01 87.12,64.01 | 84.58,62.99 84.58,60.2
  Bottom 0.203: X7.2 84.58,62.99
V_SENSE0  (via drill 0.35)
  Top 0.203: R15.1 TP1.TP 45.21,18.8 R13.2 | R13.2 45.49,19.64 D28.C | R13.2 43.69,19.91 43.69,26.29 v43.56,26.29
  Bottom 0.203: v43.56,26.29 43.38,26.11 27.43,26.11 JP1.2
V_SENSE1  (via drill 0.35)
  Top 0.203: R10.1 60.2,15.41 TP2.TP 59.94,17.53 59.94,19.66 | 59.94,19.66 R9.2 58.32,19.66 58.17,19.81 58.17,27.43 v58.42,27.43 | 59.94,19.66 61.19,19.66 D19.C
  Bottom 0.203: v58.42,27.43 40.39,27.43 40.39,28.96 28.7,28.96 JP1.4
V_SENSE2  (via drill 0.35)
  Top 0.203: R6.1 74.68,17.27 TP3.TP 74.42,19.53 R5.2 | R5.2 76.05,20.04 D10.C | R5.2 72.42,20.04 72.39,20.07 72.39,25.65 72.9,26.16 v73.91,26.16
  Bottom 0.203: v73.91,26.16 73.91,27.66 68.45,27.66 62.19,33.91 28.58,33.91 JP1.6
V_SENSE3  (via drill 0.35)
  Top 0.203: R2.1 89.41,17.02 TP4.TP R1.2 | R1.2 90.65,19.66 D1.C | R1.2 87.12,19.66 87.12,25.15 88.39,26.42 v88.27,26.54
  Bottom 0.203: v88.27,26.54 88.27,29.34 72.01,29.34 64.95,36.4 28.53,36.4 JP1.8
VCC
  Top 0.203: U1.6 58.67,65.34 57.85,65.34 57.85,71.31 58.17,71.63 64.01,71.63 64.26,71.37 64.26,69.72 C41.1 69.09,69.6 69.09,67.64 T1.P1
  Top 0.508: JP3.4 31.75,71.63 13.97,71.63 13.97,30.48 SV1.16
  Top 0.61: J1.PWR 58.45,65.12 58.67,65.34
  Bottom 0.203: JP3.4 29.72,68.07 29.72,70.61 | JP3.1 29.72,75.69 29.72,73.15 | JP3.2 29.72,73.15 | JP3.3 29.72,70.61 | 29.72,70.61 29.72,73.15
  Bottom 0.61: J1.PWR 32.17,65.12 31.75,65.53 JP3.4
  pour Top: 67.56,66.8 69.85,66.8 69.85,72.39 57.91,72.39 57.66,72.14 57.66,64.26 59.69,64.26 59.69,66.04 59.44,66.29 58.93,66.29 58.93,70.87 64.52,70.87 64.52,68.07 67.82,68.07 67.82,67.06
VO0
  Top 0.203: X6.1 50.67,8.38 | 50.67,8.38 50.67,10.52 R14.2 46.85,10.64 R15.2 | C32.1 50.67,8.38
VO1
  Top 0.203: 64.52,8.13 R11.2 60.82,10.39 R10.2 | 64.52,8.13 64.52,3.96 X5.1 | C19.1 64.52,8.13
VO2
  Top 0.203: R6.2 78.5,10.88 R7.2 79.12,10.26 79.12,8.38 | 79.12,8.38 X3.1 | C10.1 79.12,8.38
VO3
  Top 0.203: 93.47,8.13 R3.2 89.42,10.64 R2.2 | C1.1 93.47,8.13 | 93.47,8.13 X4.1

### Text on the board
tPlace: 3.3-9V 1.5W | GND | CH0 | CH1 | CH2 | CH3 | GND